# Altium schematic sheet FlatSat Half 2.SchDoc
size A2
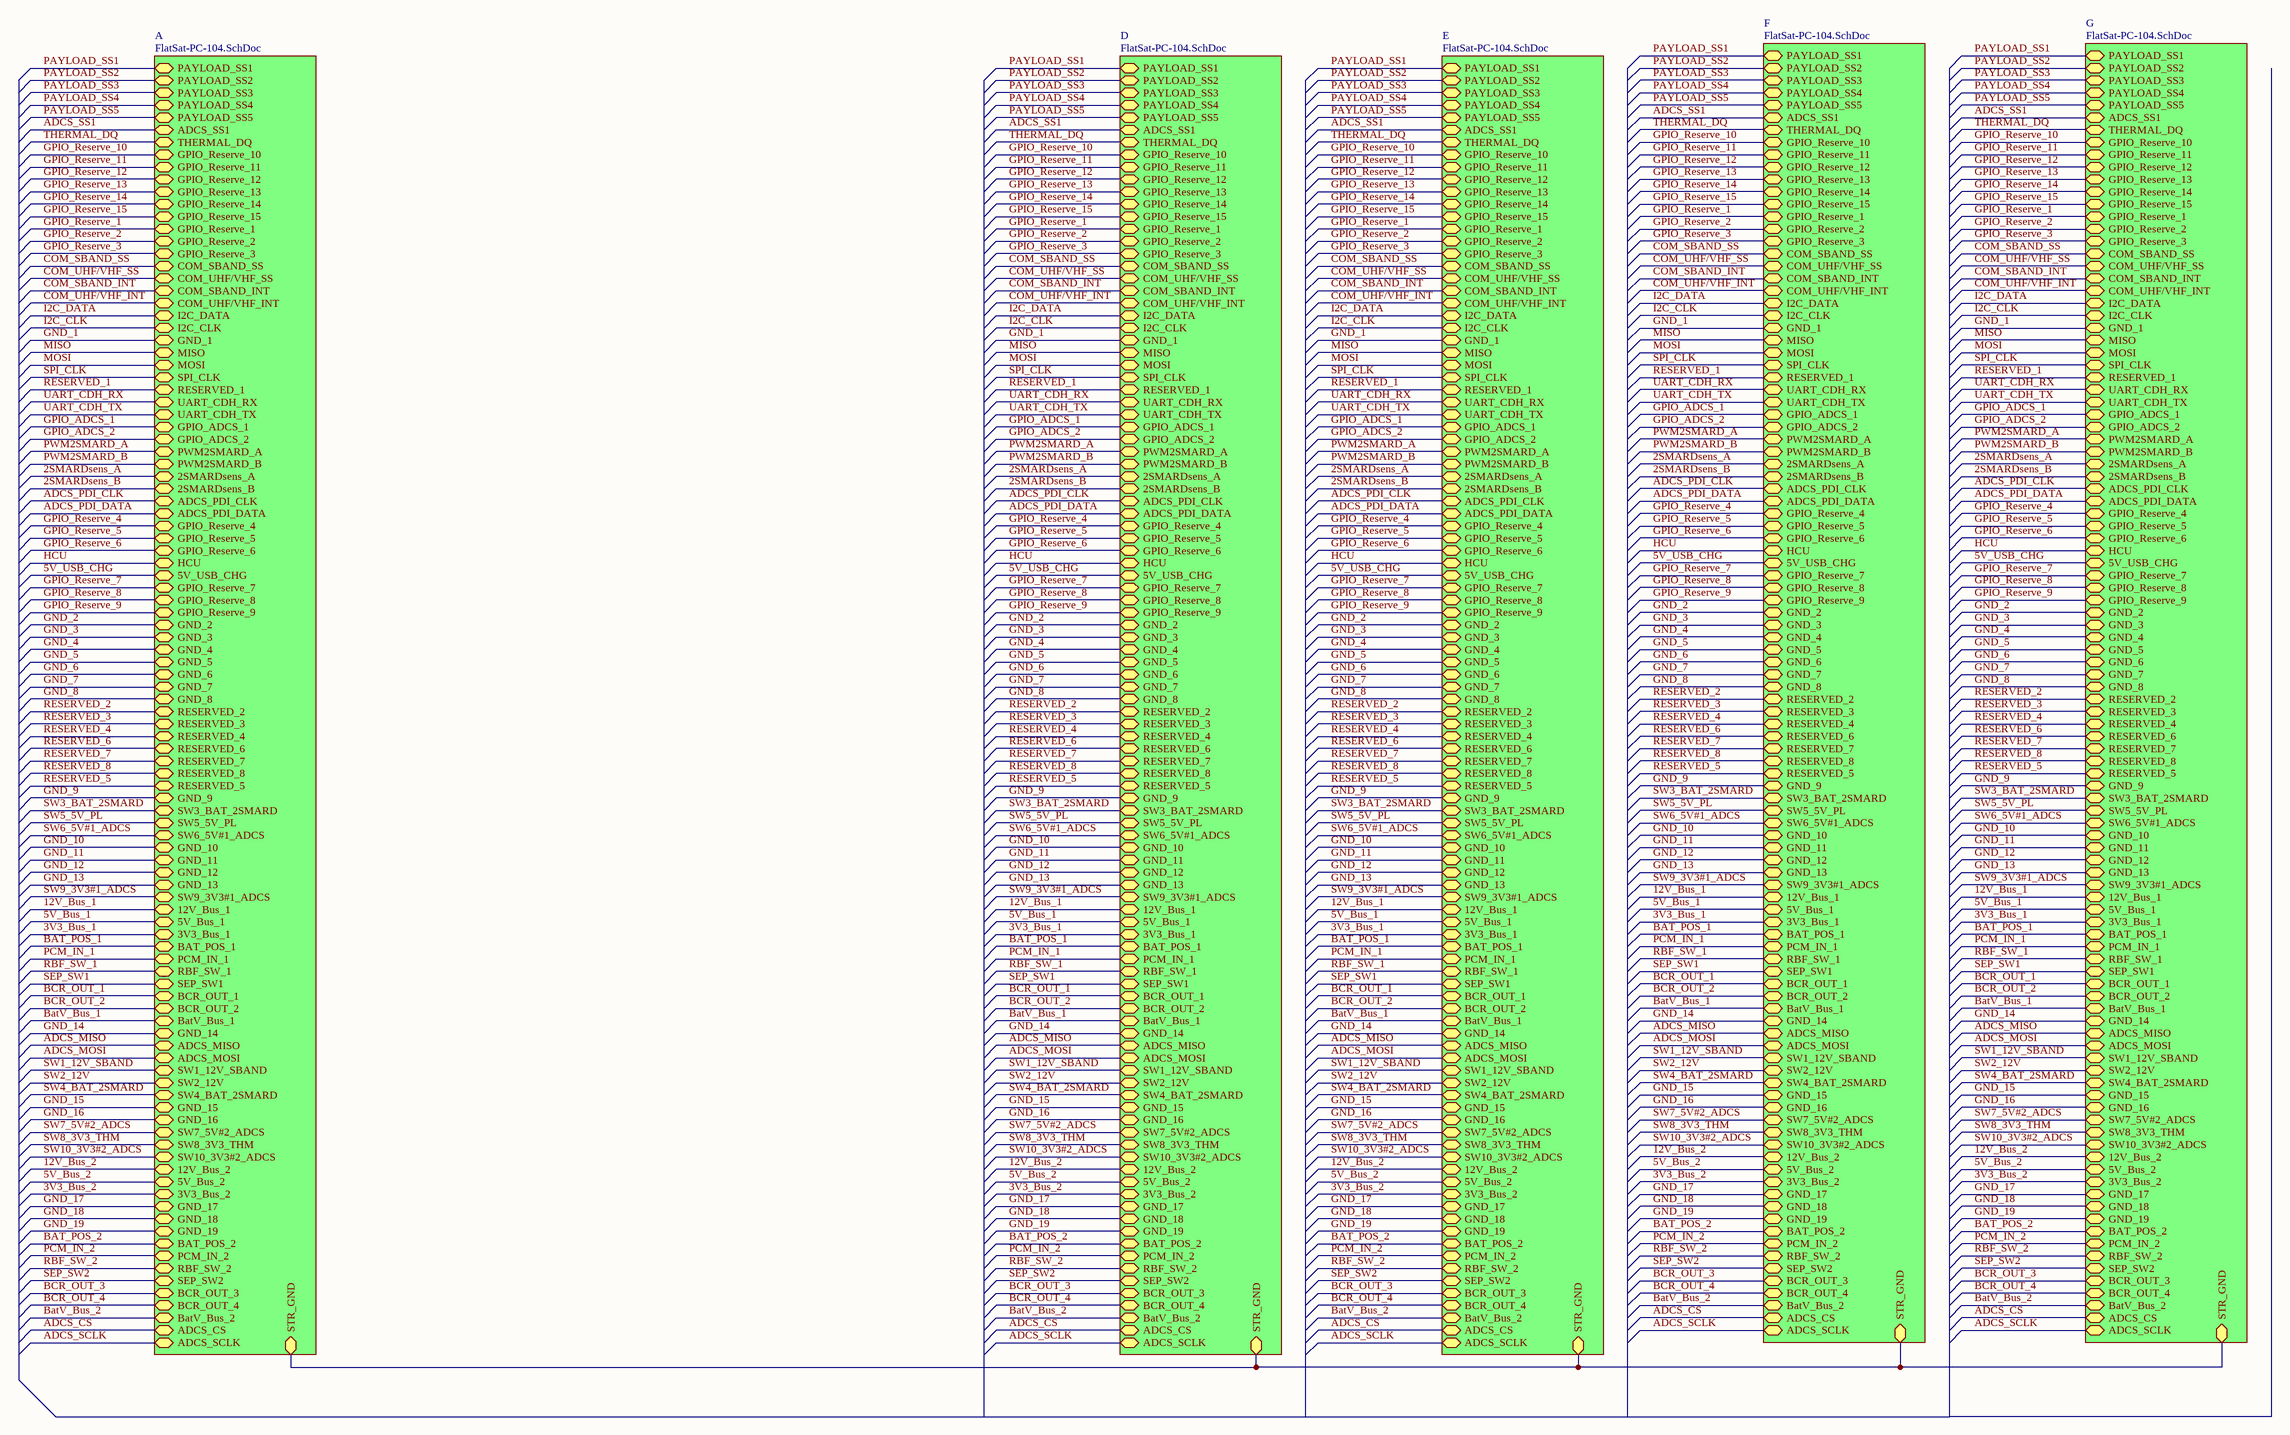
[diagram p0: FlatSat Half 2.SchDoc]

## Sub-sheets
A = FlatSat-PC-104.SchDoc: PAYLOAD_SS1 (bidir), PAYLOAD_SS2 (bidir), PAYLOAD_SS3 (bidir), PAYLOAD_SS4 (bidir), PAYLOAD_SS5 (bidir), ADCS_SS1 (bidir), THERMAL_DQ (bidir), GPIO_Reserve_10 (bidir), GPIO_Reserve_11 (bidir), GPIO_Reserve_12 (bidir), GPIO_Reserve_13 (bidir), GPIO_Reserve_14 (bidir), GPIO_Reserve_15 (bidir), GPIO_Reserve_1 (bidir), GPIO_Reserve_2 (bidir), GPIO_Reserve_3 (bidir), COM_SBAND_SS (bidir), COM_UHF/VHF_SS (bidir), COM_SBAND_INT (bidir), COM_UHF/VHF_INT (bidir), I2C_DATA (bidir), I2C_CLK (bidir), GND_1 (bidir), MISO (bidir), MOSI (bidir), SPI_CLK (bidir), RESERVED_1 (bidir), UART_CDH_RX (bidir), UART_CDH_TX (bidir), GPIO_ADCS_1 (bidir), GPIO_ADCS_2 (bidir), PWM2SMARD_A (bidir), PWM2SMARD_B (bidir), 2SMARDsens_A (bidir), 2SMARDsens_B (bidir), ADCS_PDI_CLK (bidir), ADCS_PDI_DATA (bidir), GPIO_Reserve_4 (bidir), GPIO_Reserve_5 (bidir), GPIO_Reserve_6 (bidir), HCU (bidir), 5V_USB_CHG (bidir), GPIO_Reserve_7 (bidir), GPIO_Reserve_8 (bidir), GPIO_Reserve_9 (bidir), GND_2 (bidir), GND_3 (bidir), GND_4 (bidir), GND_5 (bidir), GND_6 (bidir), GND_7 (bidir), GND_8 (bidir), RESERVED_2 (bidir), RESERVED_3 (bidir), RESERVED_4 (bidir), RESERVED_6 (bidir), RESERVED_7 (bidir), RESERVED_8 (bidir), RESERVED_5 (bidir), GND_9 (bidir), SW3_BAT_2SMARD (bidir), SW5_5V_PL (bidir), SW6_5V#1_ADCS (bidir), GND_10 (bidir), GND_11 (bidir), GND_12 (bidir), GND_13 (bidir), SW9_3V3#1_ADCS (bidir), 12V_Bus_1 (bidir), 5V_Bus_1 (bidir), 3V3_Bus_1 (bidir), BAT_POS_1 (bidir), PCM_IN_1 (bidir), RBF_SW_1 (bidir), SEP_SW1 (bidir), BCR_OUT_1 (bidir), BCR_OUT_2 (bidir), BatV_Bus_1 (bidir), GND_14 (bidir), ADCS_MISO (bidir), ADCS_MOSI (bidir), SW1_12V_SBAND (bidir), SW2_12V (bidir), SW4_BAT_2SMARD (bidir), GND_15 (bidir), GND_16 (bidir), SW7_5V#2_ADCS (bidir), SW8_3V3_THM (bidir), SW10_3V3#2_ADCS (bidir), 12V_Bus_2 (bidir), 5V_Bus_2 (bidir), 3V3_Bus_2 (bidir), GND_17 (bidir), GND_18 (bidir), GND_19 (bidir), BAT_POS_2 (bidir), PCM_IN_2 (bidir), RBF_SW_2 (bidir), SEP_SW2 (bidir), BCR_OUT_3 (bidir), BCR_OUT_4 (bidir), BatV_Bus_2 (bidir), ADCS_CS (bidir), ADCS_SCLK (bidir), STR_GND (bidir)
D = FlatSat-PC-104.SchDoc: PAYLOAD_SS1 (bidir), PAYLOAD_SS2 (bidir), PAYLOAD_SS3 (bidir), PAYLOAD_SS4 (bidir), PAYLOAD_SS5 (bidir), ADCS_SS1 (bidir), THERMAL_DQ (bidir), GPIO_Reserve_10 (bidir), GPIO_Reserve_11 (bidir), GPIO_Reserve_12 (bidir), GPIO_Reserve_13 (bidir), GPIO_Reserve_14 (bidir), GPIO_Reserve_15 (bidir), GPIO_Reserve_1 (bidir), GPIO_Reserve_2 (bidir), GPIO_Reserve_3 (bidir), COM_SBAND_SS (bidir), COM_UHF/VHF_SS (bidir), COM_SBAND_INT (bidir), COM_UHF/VHF_INT (bidir), I2C_DATA (bidir), I2C_CLK (bidir), GND_1 (bidir), MISO (bidir), MOSI (bidir), SPI_CLK (bidir), RESERVED_1 (bidir), UART_CDH_RX (bidir), UART_CDH_TX (bidir), GPIO_ADCS_1 (bidir), GPIO_ADCS_2 (bidir), PWM2SMARD_A (bidir), PWM2SMARD_B (bidir), 2SMARDsens_A (bidir), 2SMARDsens_B (bidir), ADCS_PDI_CLK (bidir), ADCS_PDI_DATA (bidir), GPIO_Reserve_4 (bidir), GPIO_Reserve_5 (bidir), GPIO_Reserve_6 (bidir), HCU (bidir), 5V_USB_CHG (bidir), GPIO_Reserve_7 (bidir), GPIO_Reserve_8 (bidir), GPIO_Reserve_9 (bidir), GND_2 (bidir), GND_3 (bidir), GND_4 (bidir), GND_5 (bidir), GND_6 (bidir), GND_7 (bidir), GND_8 (bidir), RESERVED_2 (bidir), RESERVED_3 (bidir), RESERVED_4 (bidir), RESERVED_6 (bidir), RESERVED_7 (bidir), RESERVED_8 (bidir), RESERVED_5 (bidir), GND_9 (bidir), SW3_BAT_2SMARD (bidir), SW5_5V_PL (bidir), SW6_5V#1_ADCS (bidir), GND_10 (bidir), GND_11 (bidir), GND_12 (bidir), GND_13 (bidir), SW9_3V3#1_ADCS (bidir), 12V_Bus_1 (bidir), 5V_Bus_1 (bidir), 3V3_Bus_1 (bidir), BAT_POS_1 (bidir), PCM_IN_1 (bidir), RBF_SW_1 (bidir), SEP_SW1 (bidir), BCR_OUT_1 (bidir), BCR_OUT_2 (bidir), BatV_Bus_1 (bidir), GND_14 (bidir), ADCS_MISO (bidir), ADCS_MOSI (bidir), SW1_12V_SBAND (bidir), SW2_12V (bidir), SW4_BAT_2SMARD (bidir), GND_15 (bidir), GND_16 (bidir), SW7_5V#2_ADCS (bidir), SW8_3V3_THM (bidir), SW10_3V3#2_ADCS (bidir), 12V_Bus_2 (bidir), 5V_Bus_2 (bidir), 3V3_Bus_2 (bidir), GND_17 (bidir), GND_18 (bidir), GND_19 (bidir), BAT_POS_2 (bidir), PCM_IN_2 (bidir), RBF_SW_2 (bidir), SEP_SW2 (bidir), BCR_OUT_3 (bidir), BCR_OUT_4 (bidir), BatV_Bus_2 (bidir), ADCS_CS (bidir), ADCS_SCLK (bidir), STR_GND (bidir)
E = FlatSat-PC-104.SchDoc: PAYLOAD_SS1 (bidir), PAYLOAD_SS2 (bidir), PAYLOAD_SS3 (bidir), PAYLOAD_SS4 (bidir), PAYLOAD_SS5 (bidir), ADCS_SS1 (bidir), THERMAL_DQ (bidir), GPIO_Reserve_10 (bidir), GPIO_Reserve_11 (bidir), GPIO_Reserve_12 (bidir), GPIO_Reserve_13 (bidir), GPIO_Reserve_14 (bidir), GPIO_Reserve_15 (bidir), GPIO_Reserve_1 (bidir), GPIO_Reserve_2 (bidir), GPIO_Reserve_3 (bidir), COM_SBAND_SS (bidir), COM_UHF/VHF_SS (bidir), COM_SBAND_INT (bidir), COM_UHF/VHF_INT (bidir), I2C_DATA (bidir), I2C_CLK (bidir), GND_1 (bidir), MISO (bidir), MOSI (bidir), SPI_CLK (bidir), RESERVED_1 (bidir), UART_CDH_RX (bidir), UART_CDH_TX (bidir), GPIO_ADCS_1 (bidir), GPIO_ADCS_2 (bidir), PWM2SMARD_A (bidir), PWM2SMARD_B (bidir), 2SMARDsens_A (bidir), 2SMARDsens_B (bidir), ADCS_PDI_CLK (bidir), ADCS_PDI_DATA (bidir), GPIO_Reserve_4 (bidir), GPIO_Reserve_5 (bidir), GPIO_Reserve_6 (bidir), HCU (bidir), 5V_USB_CHG (bidir), GPIO_Reserve_7 (bidir), GPIO_Reserve_8 (bidir), GPIO_Reserve_9 (bidir), GND_2 (bidir), GND_3 (bidir), GND_4 (bidir), GND_5 (bidir), GND_6 (bidir), GND_7 (bidir), GND_8 (bidir), RESERVED_2 (bidir), RESERVED_3 (bidir), RESERVED_4 (bidir), RESERVED_6 (bidir), RESERVED_7 (bidir), RESERVED_8 (bidir), RESERVED_5 (bidir), GND_9 (bidir), SW3_BAT_2SMARD (bidir), SW5_5V_PL (bidir), SW6_5V#1_ADCS (bidir), GND_10 (bidir), GND_11 (bidir), GND_12 (bidir), GND_13 (bidir), SW9_3V3#1_ADCS (bidir), 12V_Bus_1 (bidir), 5V_Bus_1 (bidir), 3V3_Bus_1 (bidir), BAT_POS_1 (bidir), PCM_IN_1 (bidir), RBF_SW_1 (bidir), SEP_SW1 (bidir), BCR_OUT_1 (bidir), BCR_OUT_2 (bidir), BatV_Bus_1 (bidir), GND_14 (bidir), ADCS_MISO (bidir), ADCS_MOSI (bidir), SW1_12V_SBAND (bidir), SW2_12V (bidir), SW4_BAT_2SMARD (bidir), GND_15 (bidir), GND_16 (bidir), SW7_5V#2_ADCS (bidir), SW8_3V3_THM (bidir), SW10_3V3#2_ADCS (bidir), 12V_Bus_2 (bidir), 5V_Bus_2 (bidir), 3V3_Bus_2 (bidir), GND_17 (bidir), GND_18 (bidir), GND_19 (bidir), BAT_POS_2 (bidir), PCM_IN_2 (bidir), RBF_SW_2 (bidir), SEP_SW2 (bidir), BCR_OUT_3 (bidir), BCR_OUT_4 (bidir), BatV_Bus_2 (bidir), ADCS_CS (bidir), ADCS_SCLK (bidir), STR_GND (bidir)
F = FlatSat-PC-104.SchDoc: PAYLOAD_SS1 (bidir), PAYLOAD_SS2 (bidir), PAYLOAD_SS3 (bidir), PAYLOAD_SS4 (bidir), PAYLOAD_SS5 (bidir), ADCS_SS1 (bidir), THERMAL_DQ (bidir), GPIO_Reserve_10 (bidir), GPIO_Reserve_11 (bidir), GPIO_Reserve_12 (bidir), GPIO_Reserve_13 (bidir), GPIO_Reserve_14 (bidir), GPIO_Reserve_15 (bidir), GPIO_Reserve_1 (bidir), GPIO_Reserve_2 (bidir), GPIO_Reserve_3 (bidir), COM_SBAND_SS (bidir), COM_UHF/VHF_SS (bidir), COM_SBAND_INT (bidir), COM_UHF/VHF_INT (bidir), I2C_DATA (bidir), I2C_CLK (bidir), GND_1 (bidir), MISO (bidir), MOSI (bidir), SPI_CLK (bidir), RESERVED_1 (bidir), UART_CDH_RX (bidir), UART_CDH_TX (bidir), GPIO_ADCS_1 (bidir), GPIO_ADCS_2 (bidir), PWM2SMARD_A (bidir), PWM2SMARD_B (bidir), 2SMARDsens_A (bidir), 2SMARDsens_B (bidir), ADCS_PDI_CLK (bidir), ADCS_PDI_DATA (bidir), GPIO_Reserve_4 (bidir), GPIO_Reserve_5 (bidir), GPIO_Reserve_6 (bidir), HCU (bidir), 5V_USB_CHG (bidir), GPIO_Reserve_7 (bidir), GPIO_Reserve_8 (bidir), GPIO_Reserve_9 (bidir), GND_2 (bidir), GND_3 (bidir), GND_4 (bidir), GND_5 (bidir), GND_6 (bidir), GND_7 (bidir), GND_8 (bidir), RESERVED_2 (bidir), RESERVED_3 (bidir), RESERVED_4 (bidir), RESERVED_6 (bidir), RESERVED_7 (bidir), RESERVED_8 (bidir), RESERVED_5 (bidir), GND_9 (bidir), SW3_BAT_2SMARD (bidir), SW5_5V_PL (bidir), SW6_5V#1_ADCS (bidir), GND_10 (bidir), GND_11 (bidir), GND_12 (bidir), GND_13 (bidir), SW9_3V3#1_ADCS (bidir), 12V_Bus_1 (bidir), 5V_Bus_1 (bidir), 3V3_Bus_1 (bidir), BAT_POS_1 (bidir), PCM_IN_1 (bidir), RBF_SW_1 (bidir), SEP_SW1 (bidir), BCR_OUT_1 (bidir), BCR_OUT_2 (bidir), BatV_Bus_1 (bidir), GND_14 (bidir), ADCS_MISO (bidir), ADCS_MOSI (bidir), SW1_12V_SBAND (bidir), SW2_12V (bidir), SW4_BAT_2SMARD (bidir), GND_15 (bidir), GND_16 (bidir), SW7_5V#2_ADCS (bidir), SW8_3V3_THM (bidir), SW10_3V3#2_ADCS (bidir), 12V_Bus_2 (bidir), 5V_Bus_2 (bidir), 3V3_Bus_2 (bidir), GND_17 (bidir), GND_18 (bidir), GND_19 (bidir), BAT_POS_2 (bidir), PCM_IN_2 (bidir), RBF_SW_2 (bidir), SEP_SW2 (bidir), BCR_OUT_3 (bidir), BCR_OUT_4 (bidir), BatV_Bus_2 (bidir), ADCS_CS (bidir), ADCS_SCLK (bidir), STR_GND (bidir)
G = FlatSat-PC-104.SchDoc: PAYLOAD_SS1 (bidir), PAYLOAD_SS2 (bidir), PAYLOAD_SS3 (bidir), PAYLOAD_SS4 (bidir), PAYLOAD_SS5 (bidir), ADCS_SS1 (bidir), THERMAL_DQ (bidir), GPIO_Reserve_10 (bidir), GPIO_Reserve_11 (bidir), GPIO_Reserve_12 (bidir), GPIO_Reserve_13 (bidir), GPIO_Reserve_14 (bidir), GPIO_Reserve_15 (bidir), GPIO_Reserve_1 (bidir), GPIO_Reserve_2 (bidir), GPIO_Reserve_3 (bidir), COM_SBAND_SS (bidir), COM_UHF/VHF_SS (bidir), COM_SBAND_INT (bidir), COM_UHF/VHF_INT (bidir), I2C_DATA (bidir), I2C_CLK (bidir), GND_1 (bidir), MISO (bidir), MOSI (bidir), SPI_CLK (bidir), RESERVED_1 (bidir), UART_CDH_RX (bidir), UART_CDH_TX (bidir), GPIO_ADCS_1 (bidir), GPIO_ADCS_2 (bidir), PWM2SMARD_A (bidir), PWM2SMARD_B (bidir), 2SMARDsens_A (bidir), 2SMARDsens_B (bidir), ADCS_PDI_CLK (bidir), ADCS_PDI_DATA (bidir), GPIO_Reserve_4 (bidir), GPIO_Reserve_5 (bidir), GPIO_Reserve_6 (bidir), HCU (bidir), 5V_USB_CHG (bidir), GPIO_Reserve_7 (bidir), GPIO_Reserve_8 (bidir), GPIO_Reserve_9 (bidir), GND_2 (bidir), GND_3 (bidir), GND_4 (bidir), GND_5 (bidir), GND_6 (bidir), GND_7 (bidir), GND_8 (bidir), RESERVED_2 (bidir), RESERVED_3 (bidir), RESERVED_4 (bidir), RESERVED_6 (bidir), RESERVED_7 (bidir), RESERVED_8 (bidir), RESERVED_5 (bidir), GND_9 (bidir), SW3_BAT_2SMARD (bidir), SW5_5V_PL (bidir), SW6_5V#1_ADCS (bidir), GND_10 (bidir), GND_11 (bidir), GND_12 (bidir), GND_13 (bidir), SW9_3V3#1_ADCS (bidir), 12V_Bus_1 (bidir), 5V_Bus_1 (bidir), 3V3_Bus_1 (bidir), BAT_POS_1 (bidir), PCM_IN_1 (bidir), RBF_SW_1 (bidir), SEP_SW1 (bidir), BCR_OUT_1 (bidir), BCR_OUT_2 (bidir), BatV_Bus_1 (bidir), GND_14 (bidir), ADCS_MISO (bidir), ADCS_MOSI (bidir), SW1_12V_SBAND (bidir), SW2_12V (bidir), SW4_BAT_2SMARD (bidir), GND_15 (bidir), GND_16 (bidir), SW7_5V#2_ADCS (bidir), SW8_3V3_THM (bidir), SW10_3V3#2_ADCS (bidir), 12V_Bus_2 (bidir), 5V_Bus_2 (bidir), 3V3_Bus_2 (bidir), GND_17 (bidir), GND_18 (bidir), GND_19 (bidir), BAT_POS_2 (bidir), PCM_IN_2 (bidir), RBF_SW_2 (bidir), SEP_SW2 (bidir), BCR_OUT_3 (bidir), BCR_OUT_4 (bidir), BatV_Bus_2 (bidir), ADCS_CS (bidir), ADCS_SCLK (bidir), STR_GND (bidir)

## Nets
2SMARDsens_A: sheet A/2SMARDsens_A, sheet D/2SMARDsens_A, sheet E/2SMARDsens_A, sheet F/2SMARDsens_A, sheet G/2SMARDsens_A
2SMARDsens_B: sheet A/2SMARDsens_B, sheet D/2SMARDsens_B, sheet E/2SMARDsens_B, sheet F/2SMARDsens_B, sheet G/2SMARDsens_B
3V3_Bus_1: sheet A/3V3_Bus_1, sheet D/3V3_Bus_1, sheet E/3V3_Bus_1, sheet F/3V3_Bus_1, sheet G/3V3_Bus_1
3V3_Bus_2: sheet A/3V3_Bus_2, sheet D/3V3_Bus_2, sheet E/3V3_Bus_2, sheet F/3V3_Bus_2, sheet G/3V3_Bus_2
5V_Bus_1: sheet A/5V_Bus_1, sheet D/5V_Bus_1, sheet E/5V_Bus_1, sheet F/5V_Bus_1, sheet G/5V_Bus_1
5V_Bus_2: sheet A/5V_Bus_2, sheet D/5V_Bus_2, sheet E/5V_Bus_2, sheet F/5V_Bus_2, sheet G/5V_Bus_2
5V_USB_CHG: sheet A/5V_USB_CHG, sheet D/5V_USB_CHG, sheet E/5V_USB_CHG, sheet F/5V_USB_CHG, sheet G/5V_USB_CHG
12V_Bus_1: sheet A/12V_Bus_1, sheet D/12V_Bus_1, sheet E/12V_Bus_1, sheet F/12V_Bus_1, sheet G/12V_Bus_1
12V_Bus_2: sheet A/12V_Bus_2, sheet D/12V_Bus_2, sheet E/12V_Bus_2, sheet F/12V_Bus_2, sheet G/12V_Bus_2
ADCS_CS: sheet A/ADCS_CS, sheet D/ADCS_CS, sheet E/ADCS_CS, sheet F/ADCS_CS, sheet G/ADCS_CS
ADCS_MISO: sheet A/ADCS_MISO, sheet D/ADCS_MISO, sheet E/ADCS_MISO, sheet F/ADCS_MISO, sheet G/ADCS_MISO
ADCS_MOSI: sheet A/ADCS_MOSI, sheet D/ADCS_MOSI, sheet E/ADCS_MOSI, sheet F/ADCS_MOSI, sheet G/ADCS_MOSI
ADCS_PDI_CLK: sheet A/ADCS_PDI_CLK, sheet D/ADCS_PDI_CLK, sheet E/ADCS_PDI_CLK, sheet F/ADCS_PDI_CLK, sheet G/ADCS_PDI_CLK
ADCS_PDI_DATA: sheet A/ADCS_PDI_DATA, sheet D/ADCS_PDI_DATA, sheet E/ADCS_PDI_DATA, sheet F/ADCS_PDI_DATA, sheet G/ADCS_PDI_DATA
ADCS_SCLK: sheet A/ADCS_SCLK, sheet D/ADCS_SCLK, sheet E/ADCS_SCLK, sheet F/ADCS_SCLK, sheet G/ADCS_SCLK
ADCS_SS1: sheet A/ADCS_SS1, sheet D/ADCS_SS1, sheet E/ADCS_SS1, sheet F/ADCS_SS1, sheet G/ADCS_SS1
BAT_POS_1: sheet A/BAT_POS_1, sheet D/BAT_POS_1, sheet E/BAT_POS_1, sheet F/BAT_POS_1, sheet G/BAT_POS_1
BAT_POS_2: sheet A/BAT_POS_2, sheet D/BAT_POS_2, sheet E/BAT_POS_2, sheet F/BAT_POS_2, sheet G/BAT_POS_2
BatV_Bus_1: sheet A/BatV_Bus_1, sheet D/BatV_Bus_1, sheet E/BatV_Bus_1, sheet F/BatV_Bus_1, sheet G/BatV_Bus_1
BatV_Bus_2: sheet A/BatV_Bus_2, sheet D/BatV_Bus_2, sheet E/BatV_Bus_2, sheet F/BatV_Bus_2, sheet G/BatV_Bus_2
BCR_OUT_1: sheet A/BCR_OUT_1, sheet D/BCR_OUT_1, sheet E/BCR_OUT_1, sheet F/BCR_OUT_1, sheet G/BCR_OUT_1
BCR_OUT_2: sheet A/BCR_OUT_2, sheet D/BCR_OUT_2, sheet E/BCR_OUT_2, sheet F/BCR_OUT_2, sheet G/BCR_OUT_2
BCR_OUT_3: sheet A/BCR_OUT_3, sheet D/BCR_OUT_3, sheet E/BCR_OUT_3, sheet F/BCR_OUT_3, sheet G/BCR_OUT_3
BCR_OUT_4: sheet A/BCR_OUT_4, sheet D/BCR_OUT_4, sheet E/BCR_OUT_4, sheet F/BCR_OUT_4, sheet G/BCR_OUT_4
COM_SBAND_INT: sheet A/COM_SBAND_INT, sheet D/COM_SBAND_INT, sheet E/COM_SBAND_INT, sheet F/COM_SBAND_INT, sheet G/COM_SBAND_INT
COM_SBAND_SS: sheet A/COM_SBAND_SS, sheet D/COM_SBAND_SS, sheet E/COM_SBAND_SS, sheet F/COM_SBAND_SS, sheet G/COM_SBAND_SS
COM_UHF/VHF_INT: sheet A/COM_UHF/VHF_INT, sheet D/COM_UHF/VHF_INT, sheet E/COM_UHF/VHF_INT, sheet F/COM_UHF/VHF_INT, sheet G/COM_UHF/VHF_INT
COM_UHF/VHF_SS: sheet A/COM_UHF/VHF_SS, sheet D/COM_UHF/VHF_SS, sheet E/COM_UHF/VHF_SS, sheet F/COM_UHF/VHF_SS, sheet G/COM_UHF/VHF_SS
GND_1: sheet A/GND_1, sheet D/GND_1, sheet E/GND_1, sheet F/GND_1, sheet G/GND_1
GND_2: sheet A/GND_2, sheet D/GND_2, sheet E/GND_2, sheet F/GND_2, sheet G/GND_2
GND_3: sheet A/GND_3, sheet D/GND_3, sheet E/GND_3, sheet F/GND_3, sheet G/GND_3
GND_4: sheet A/GND_4, sheet D/GND_4, sheet E/GND_4, sheet F/GND_4, sheet G/GND_4
GND_5: sheet A/GND_5, sheet D/GND_5, sheet E/GND_5, sheet F/GND_5, sheet G/GND_5
GND_6: sheet A/GND_6, sheet D/GND_6, sheet E/GND_6, sheet F/GND_6, sheet G/GND_6
GND_7: sheet A/GND_7, sheet D/GND_7, sheet E/GND_7, sheet F/GND_7, sheet G/GND_7
GND_8: sheet A/GND_8, sheet D/GND_8, sheet E/GND_8, sheet F/GND_8, sheet G/GND_8
GND_9: sheet A/GND_9, sheet D/GND_9, sheet E/GND_9, sheet F/GND_9, sheet G/GND_9
GND_10: sheet A/GND_10, sheet D/GND_10, sheet E/GND_10, sheet F/GND_10, sheet G/GND_10
GND_11: sheet A/GND_11, sheet D/GND_11, sheet E/GND_11, sheet F/GND_11, sheet G/GND_11
GND_12: sheet A/GND_12, sheet D/GND_12, sheet E/GND_12, sheet F/GND_12, sheet G/GND_12
GND_13: sheet A/GND_13, sheet D/GND_13, sheet E/GND_13, sheet F/GND_13, sheet G/GND_13
GND_14: sheet A/GND_14, sheet D/GND_14, sheet E/GND_14, sheet F/GND_14, sheet G/GND_14
GND_15: sheet A/GND_15, sheet D/GND_15, sheet E/GND_15, sheet F/GND_15, sheet G/GND_15
GND_16: sheet A/GND_16, sheet D/GND_16, sheet E/GND_16, sheet F/GND_16, sheet G/GND_16
GND_17: sheet A/GND_17, sheet D/GND_17, sheet E/GND_17, sheet F/GND_17, sheet G/GND_17
GND_18: sheet A/GND_18, sheet D/GND_18, sheet E/GND_18, sheet F/GND_18, sheet G/GND_18
GND_19: sheet A/GND_19, sheet D/GND_19, sheet E/GND_19, sheet F/GND_19, sheet G/GND_19
GPIO_ADCS_1: sheet A/GPIO_ADCS_1, sheet D/GPIO_ADCS_1, sheet E/GPIO_ADCS_1, sheet F/GPIO_ADCS_1, sheet G/GPIO_ADCS_1
GPIO_ADCS_2: sheet A/GPIO_ADCS_2, sheet D/GPIO_ADCS_2, sheet E/GPIO_ADCS_2, sheet F/GPIO_ADCS_2, sheet G/GPIO_ADCS_2
GPIO_Reserve_1: sheet A/GPIO_Reserve_1, sheet D/GPIO_Reserve_1, sheet E/GPIO_Reserve_1, sheet F/GPIO_Reserve_1, sheet G/GPIO_Reserve_1
GPIO_Reserve_2: sheet A/GPIO_Reserve_2, sheet D/GPIO_Reserve_2, sheet E/GPIO_Reserve_2, sheet F/GPIO_Reserve_2, sheet G/GPIO_Reserve_2
GPIO_Reserve_3: sheet A/GPIO_Reserve_3, sheet D/GPIO_Reserve_3, sheet E/GPIO_Reserve_3, sheet F/GPIO_Reserve_3, sheet G/GPIO_Reserve_3
GPIO_Reserve_4: sheet A/GPIO_Reserve_4, sheet D/GPIO_Reserve_4, sheet E/GPIO_Reserve_4, sheet F/GPIO_Reserve_4, sheet G/GPIO_Reserve_4
GPIO_Reserve_5: sheet A/GPIO_Reserve_5, sheet D/GPIO_Reserve_5, sheet E/GPIO_Reserve_5, sheet F/GPIO_Reserve_5, sheet G/GPIO_Reserve_5
GPIO_Reserve_6: sheet A/GPIO_Reserve_6, sheet D/GPIO_Reserve_6, sheet E/GPIO_Reserve_6, sheet F/GPIO_Reserve_6, sheet G/GPIO_Reserve_6
GPIO_Reserve_7: sheet A/GPIO_Reserve_7, sheet D/GPIO_Reserve_7, sheet E/GPIO_Reserve_7, sheet F/GPIO_Reserve_7, sheet G/GPIO_Reserve_7
GPIO_Reserve_8: sheet A/GPIO_Reserve_8, sheet D/GPIO_Reserve_8, sheet E/GPIO_Reserve_8, sheet F/GPIO_Reserve_8, sheet G/GPIO_Reserve_8
GPIO_Reserve_9: sheet A/GPIO_Reserve_9, sheet D/GPIO_Reserve_9, sheet E/GPIO_Reserve_9, sheet F/GPIO_Reserve_9, sheet G/GPIO_Reserve_9
GPIO_Reserve_10: sheet A/GPIO_Reserve_10, sheet D/GPIO_Reserve_10, sheet E/GPIO_Reserve_10, sheet F/GPIO_Reserve_10, sheet G/GPIO_Reserve_10
GPIO_Reserve_11: sheet A/GPIO_Reserve_11, sheet D/GPIO_Reserve_11, sheet E/GPIO_Reserve_11, sheet F/GPIO_Reserve_11, sheet G/GPIO_Reserve_11
GPIO_Reserve_12: sheet A/GPIO_Reserve_12, sheet D/GPIO_Reserve_12, sheet E/GPIO_Reserve_12, sheet F/GPIO_Reserve_12, sheet G/GPIO_Reserve_12
GPIO_Reserve_13: sheet A/GPIO_Reserve_13, sheet D/GPIO_Reserve_13, sheet E/GPIO_Reserve_13, sheet F/GPIO_Reserve_13, sheet G/GPIO_Reserve_13
GPIO_Reserve_14: sheet A/GPIO_Reserve_14, sheet D/GPIO_Reserve_14, sheet E/GPIO_Reserve_14, sheet F/GPIO_Reserve_14, sheet G/GPIO_Reserve_14
GPIO_Reserve_15: sheet A/GPIO_Reserve_15, sheet D/GPIO_Reserve_15, sheet E/GPIO_Reserve_15, sheet F/GPIO_Reserve_15, sheet G/GPIO_Reserve_15
HCU: sheet A/HCU, sheet D/HCU, sheet E/HCU, sheet F/HCU, sheet G/HCU
I2C_CLK: sheet A/I2C_CLK, sheet D/I2C_CLK, sheet E/I2C_CLK, sheet F/I2C_CLK, sheet G/I2C_CLK
I2C_DATA: sheet A/I2C_DATA, sheet D/I2C_DATA, sheet E/I2C_DATA, sheet F/I2C_DATA, sheet G/I2C_DATA
MISO: sheet A/MISO, sheet D/MISO, sheet E/MISO, sheet F/MISO, sheet G/MISO
MOSI: sheet A/MOSI, sheet D/MOSI, sheet E/MOSI, sheet F/MOSI, sheet G/MOSI
PAYLOAD_SS1: sheet A/PAYLOAD_SS1, sheet D/PAYLOAD_SS1, sheet E/PAYLOAD_SS1, sheet F/PAYLOAD_SS1, sheet G/PAYLOAD_SS1
PAYLOAD_SS2: sheet A/PAYLOAD_SS2, sheet D/PAYLOAD_SS2, sheet E/PAYLOAD_SS2, sheet F/PAYLOAD_SS2, sheet G/PAYLOAD_SS2
PAYLOAD_SS3: sheet A/PAYLOAD_SS3, sheet D/PAYLOAD_SS3, sheet E/PAYLOAD_SS3, sheet F/PAYLOAD_SS3, sheet G/PAYLOAD_SS3
PAYLOAD_SS4: sheet A/PAYLOAD_SS4, sheet D/PAYLOAD_SS4, sheet E/PAYLOAD_SS4, sheet F/PAYLOAD_SS4, sheet G/PAYLOAD_SS4
PAYLOAD_SS5: sheet A/PAYLOAD_SS5, sheet D/PAYLOAD_SS5, sheet E/PAYLOAD_SS5, sheet F/PAYLOAD_SS5, sheet G/PAYLOAD_SS5
PCM_IN_1: sheet A/PCM_IN_1, sheet D/PCM_IN_1, sheet E/PCM_IN_1, sheet F/PCM_IN_1, sheet G/PCM_IN_1
PCM_IN_2: sheet A/PCM_IN_2, sheet D/PCM_IN_2, sheet E/PCM_IN_2, sheet F/PCM_IN_2, sheet G/PCM_IN_2
PWM2SMARD_A: sheet A/PWM2SMARD_A, sheet D/PWM2SMARD_A, sheet E/PWM2SMARD_A, sheet F/PWM2SMARD_A, sheet G/PWM2SMARD_A
PWM2SMARD_B: sheet A/PWM2SMARD_B, sheet D/PWM2SMARD_B, sheet E/PWM2SMARD_B, sheet F/PWM2SMARD_B, sheet G/PWM2SMARD_B
RBF_SW_1: sheet A/RBF_SW_1, sheet D/RBF_SW_1, sheet E/RBF_SW_1, sheet F/RBF_SW_1, sheet G/RBF_SW_1
RBF_SW_2: sheet A/RBF_SW_2, sheet D/RBF_SW_2, sheet E/RBF_SW_2, sheet F/RBF_SW_2, sheet G/RBF_SW_2
RESERVED_1: sheet A/RESERVED_1, sheet D/RESERVED_1, sheet E/RESERVED_1, sheet F/RESERVED_1, sheet G/RESERVED_1
RESERVED_2: sheet A/RESERVED_2, sheet D/RESERVED_2, sheet E/RESERVED_2, sheet F/RESERVED_2, sheet G/RESERVED_2
RESERVED_3: sheet A/RESERVED_3, sheet D/RESERVED_3, sheet E/RESERVED_3, sheet F/RESERVED_3, sheet G/RESERVED_3
RESERVED_4: sheet A/RESERVED_4, sheet D/RESERVED_4, sheet E/RESERVED_4, sheet F/RESERVED_4, sheet G/RESERVED_4
RESERVED_5: sheet A/RESERVED_5, sheet D/RESERVED_5, sheet E/RESERVED_5, sheet F/RESERVED_5, sheet G/RESERVED_5
RESERVED_6: sheet A/RESERVED_6, sheet D/RESERVED_6, sheet E/RESERVED_6, sheet F/RESERVED_6, sheet G/RESERVED_6
RESERVED_7: sheet A/RESERVED_7, sheet D/RESERVED_7, sheet E/RESERVED_7, sheet F/RESERVED_7, sheet G/RESERVED_7
RESERVED_8: sheet A/RESERVED_8, sheet D/RESERVED_8, sheet E/RESERVED_8, sheet F/RESERVED_8, sheet G/RESERVED_8
SEP_SW1: sheet A/SEP_SW1, sheet D/SEP_SW1, sheet E/SEP_SW1, sheet F/SEP_SW1, sheet G/SEP_SW1
SEP_SW2: sheet A/SEP_SW2, sheet D/SEP_SW2, sheet E/SEP_SW2, sheet F/SEP_SW2, sheet G/SEP_SW2
SPI_CLK: sheet A/SPI_CLK, sheet D/SPI_CLK, sheet E/SPI_CLK, sheet F/SPI_CLK, sheet G/SPI_CLK
SW1_12V_SBAND: sheet A/SW1_12V_SBAND, sheet D/SW1_12V_SBAND, sheet E/SW1_12V_SBAND, sheet F/SW1_12V_SBAND, sheet G/SW1_12V_SBAND
SW2_12V: sheet A/SW2_12V, sheet D/SW2_12V, sheet E/SW2_12V, sheet F/SW2_12V, sheet G/SW2_12V
SW3_BAT_2SMARD: sheet A/SW3_BAT_2SMARD, sheet D/SW3_BAT_2SMARD, sheet E/SW3_BAT_2SMARD, sheet F/SW3_BAT_2SMARD, sheet G/SW3_BAT_2SMARD
SW4_BAT_2SMARD: sheet A/SW4_BAT_2SMARD, sheet D/SW4_BAT_2SMARD, sheet E/SW4_BAT_2SMARD, sheet F/SW4_BAT_2SMARD, sheet G/SW4_BAT_2SMARD
SW5_5V_PL: sheet A/SW5_5V_PL, sheet D/SW5_5V_PL, sheet E/SW5_5V_PL, sheet F/SW5_5V_PL, sheet G/SW5_5V_PL
SW6_5V#1_ADCS: sheet A/SW6_5V#1_ADCS, sheet D/SW6_5V#1_ADCS, sheet E/SW6_5V#1_ADCS, sheet F/SW6_5V#1_ADCS, sheet G/SW6_5V#1_ADCS
SW7_5V#2_ADCS: sheet A/SW7_5V#2_ADCS, sheet D/SW7_5V#2_ADCS, sheet E/SW7_5V#2_ADCS, sheet F/SW7_5V#2_ADCS, sheet G/SW7_5V#2_ADCS
SW8_3V3_THM: sheet A/SW8_3V3_THM, sheet D/SW8_3V3_THM, sheet E/SW8_3V3_THM, sheet F/SW8_3V3_THM, sheet G/SW8_3V3_THM
SW9_3V3#1_ADCS: sheet A/SW9_3V3#1_ADCS, sheet D/SW9_3V3#1_ADCS, sheet E/SW9_3V3#1_ADCS, sheet F/SW9_3V3#1_ADCS, sheet G/SW9_3V3#1_ADCS
SW10_3V3#2_ADCS: sheet A/SW10_3V3#2_ADCS, sheet D/SW10_3V3#2_ADCS, sheet E/SW10_3V3#2_ADCS, sheet F/SW10_3V3#2_ADCS, sheet G/SW10_3V3#2_ADCS
THERMAL_DQ: sheet A/THERMAL_DQ, sheet D/THERMAL_DQ, sheet E/THERMAL_DQ, sheet F/THERMAL_DQ, sheet G/THERMAL_DQ
UART_CDH_RX: sheet A/UART_CDH_RX, sheet D/UART_CDH_RX, sheet E/UART_CDH_RX, sheet F/UART_CDH_RX, sheet G/UART_CDH_RX
UART_CDH_TX: sheet A/UART_CDH_TX, sheet D/UART_CDH_TX, sheet E/UART_CDH_TX, sheet F/UART_CDH_TX, sheet G/UART_CDH_TX
(unnamed): sheet A/STR_GND, sheet D/STR_GND, sheet E/STR_GND, sheet F/STR_GND, sheet G/STR_GND